# Altium schematic sheet STM32F401R.SchDoc
size A4
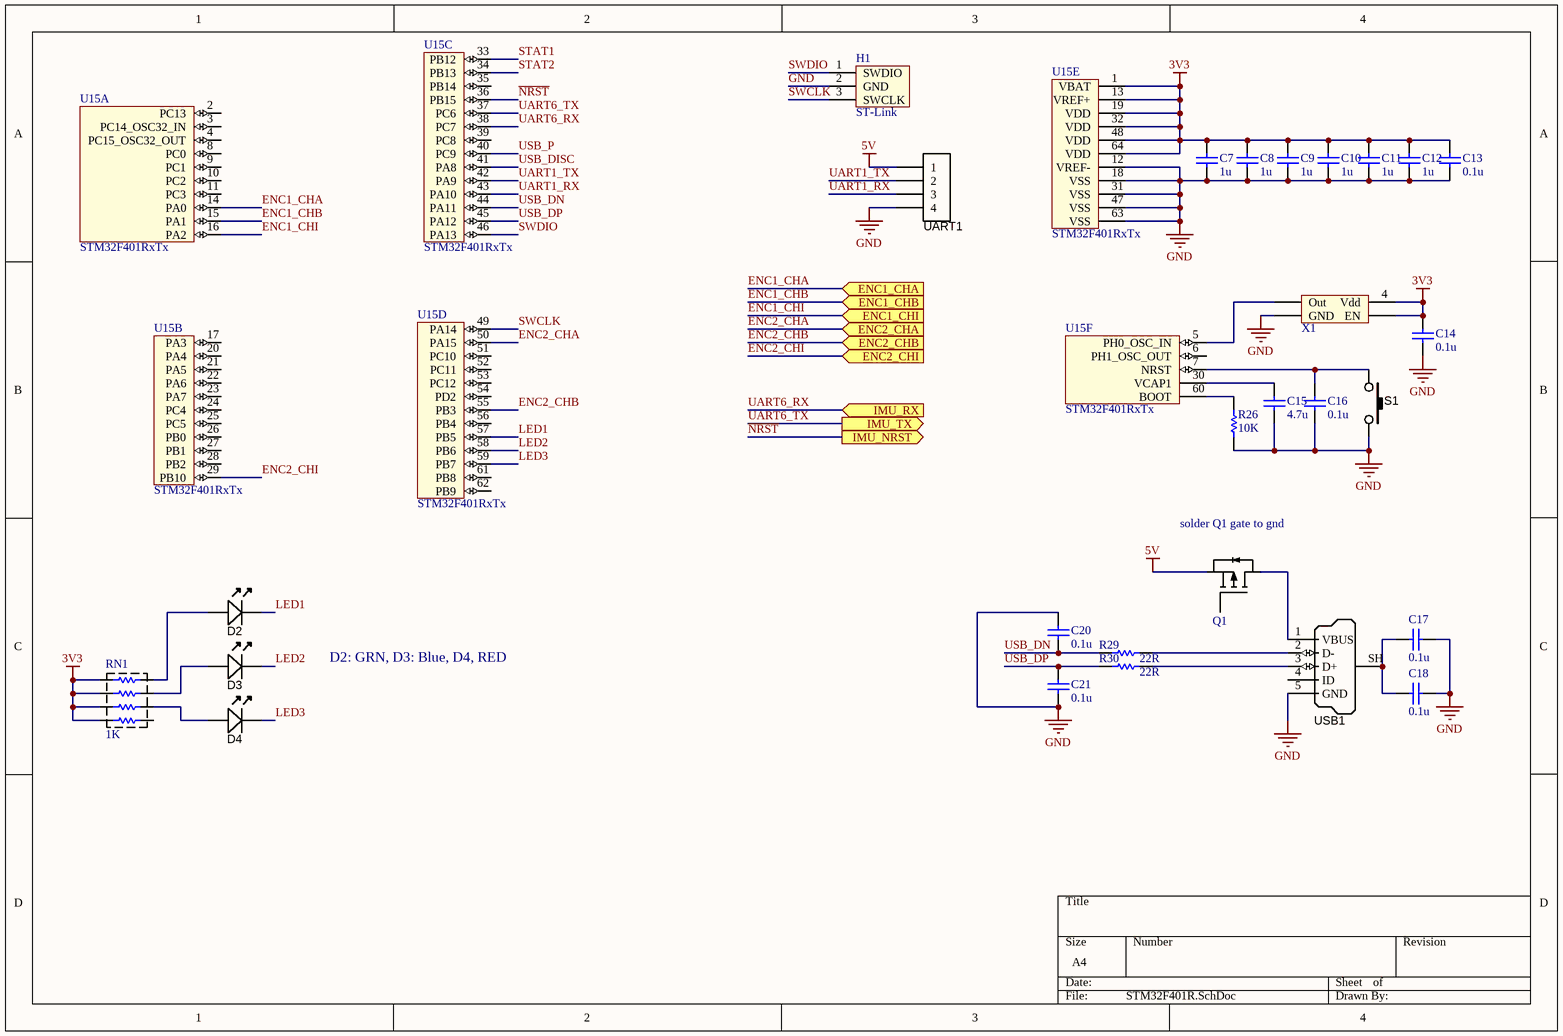
[diagram p0: STM32F401R.SchDoc]

## Parts
C7  value 1u  [CAPC1608X90N]  (hidden comment: Cap)
C8  value 1u  [CAPC1608X90N]  (hidden comment: Cap)
C9  value 1u  [CAPC1608X90N]  (hidden comment: Cap)
C10  value 1u  [CAPC1608X90N]  (hidden comment: Cap)
C11  value 1u  [CAPC1608X90N]  (hidden comment: Cap)
C12  value 1u  [CAPC1608X90N]  (hidden comment: Cap)
C13  value 0.1u  [CAPC1608X90N]  (hidden comment: Cap)
C14  value 0.1u  [CAPC1608X90N]  (hidden comment: Cap)
C15  value 4.7u  [CAPC1608X90N]  (hidden comment: Cap)
C16  value 0.1u  [CAPC1608X90N]  (hidden comment: Cap)
C17  value 0.1u  [CAPC1608X90N]  (hidden comment: Cap)
C18  value 0.1u  [CAPC1608X90N]  (hidden comment: Cap)
C20  value 0.1u  [CAPC1608X90N]  (hidden comment: Cap)
C21  value 0.1u  [CAPC1608X90N]  (hidden comment: Cap)
D2  LED_Green_GullWing  [LED-0805-A]  (value not drawn)
D3  LED_Green_GullWing  [LED-0805-A]  (value not drawn)
D4  LED_Green_GullWing  [LED-0805-A]  (value not drawn)
H1  ST-Link  [ST-Link]
Q1  DMP4010SK3Q  [TO-252]  (value not drawn)
R26  value 10K  [RESC1608X55N]  (hidden comment: Res1)
R29  value 22R  [RESC1608X55N]  (hidden comment: Res1)
R30  value 22R  [RESC1608X55N]  (hidden comment: Res1)
RN1  value 1K  [RESCAXS50P160X320X70-8N]  (hidden comment: resistor network)
S1  SW_THT_PB_4.3mm  [TACT_SWT-SMD-4.4]  (value not drawn)
U15  STM32F401RxTx  [LQFP64]  (parts A,B,C,D,E,F of 6)
UART1  Programmer  [HDR1X4_2.54MMP]  (value not drawn)  (no BOM)
USB1  USB Micro Type B  [USB_MICRO-B]  (value not drawn)
X1  ASV-8.000MHZ-EJ-T  [ASV SERIES]  (value not drawn)

## Ports
ENC1_CHA (in), ENC1_CHB (in), ENC1_CHI (in), ENC2_CHA (in), ENC2_CHB (in), ENC2_CHI (in), IMU_NRST (out), IMU_RX (in), IMU_TX (out)

## Nets
3V3: C7.2 C8.2 C9.2 C10.2 C11.2 C12.2 C13.2 C14.2 RN1.1 RN1.2 RN1.3 RN1.4 U15.1(VBAT) U15.13(VREF+) U15.19(VDD) U15.32(VDD) U15.48(VDD) U15.64(VDD) X1.1(EN) X1.4(Vdd)
5V: Q1.3(S) UART1.1
GND: C7.1 C8.1 C9.1 C10.1 C11.1 C12.1 C13.1 C14.1 C15.1 C16.1 C17.2 C18.2 C20.2 C21.1 H1.2(GND) R26.1 S1.2 U15.12(VREF-) U15.18(VSS) U15.31(VSS) U15.47(VSS) U15.63(VSS) UART1.4 USB1.5(GND) X1.2(GND)
ENC1_CHA: U15.14(PA0) ; port ENC1_CHA
ENC1_CHB: U15.15(PA1) ; port ENC1_CHB
ENC1_CHI: U15.16(PA2) ; port ENC1_CHI
ENC2_CHA: U15.50(PA15) ; port ENC2_CHA
ENC2_CHB: U15.55(PB3) ; port ENC2_CHB
ENC2_CHI: U15.29(PB10) ; port ENC2_CHI
LED1: D2.K U15.57(PB5)
LED2: D3.K U15.58(PB6)
LED3: D4.K U15.59(PB7)
~{NRST}: U15.36(PB15) ; port IMU_NRST
STAT1: U15.33(PB12)
STAT2: U15.34(PB13)
SWCLK: H1.3(SWCLK) U15.49(PA14)
SWDIO: H1.1(SWDIO) U15.46(PA13)
UART1_RX: U15.43(PA10) UART1.3
UART1_TX: U15.42(PA9) UART1.2
UART6_RX: U15.38(PC7) ; port IMU_RX
UART6_TX: U15.37(PC6) ; port IMU_TX
USB_DISC: U15.41(PA8)
USB_DN: C20.1 R29.1 U15.44(PA11)
USB_DP: C21.2 R30.1 U15.45(PA12)
USB_P: U15.40(PC9)
NetC15_2: C15.2 U15.30(VCAP1)
NetC16_2: C16.2 S1.1 U15.7(NRST)
NetC17_1: C17.1 C18.1 USB1.SH(Shell)
NetD2_A: D2.A RN1.8
NetD3_A: D3.A RN1.7
NetD4_A: D4.A RN1.6
NetQ1_4: Q1.4(D) USB1.1(VBUS)
NetR26_2: R26.2 U15.60(BOOT)
NetR29_2: R29.2 USB1.2(D-)
NetR30_2: R30.2 USB1.3(D+)
NetU15_5: U15.5(PH0_OSC_IN) X1.3(Out)

Not connected (* = marked no-connect by the designer): Q1 1(G); RN1 5; U15 2(PC13) 3(PC14_OSC32_IN) 4(PC15_OSC32_OUT) 6(PH1_OSC_OUT) 8(PC0) 9(PC1) 10(PC2) 11(PC3) 17(PA3) 20(PA4) 21(PA5) 22(PA6) 23(PA7) 24(PC4) 25(PC5) 26(PB0) 27(PB1) 28(PB2) 35(PB14) 39(PC8) 51(PC10) 52(PC11) 53(PC12) 54(PD2) 56(PB4) 61(PB8) 62(PB9); USB1 4(ID)

## Notes on the sheet
- (near Q1) solder Q1 gate to gnd
- D2: GRN, D3: Blue, D4, RED

## Library data of the parts
C7-C18 C20 C21 = Cap: Capacitor; Published: 8-Jun-2000; LatestRevisionDate: 17-Jul-2002; LatestRevisionNote: Re-released for DXP Platform.; PackageReference: RAD-0.3; Publisher: Altium Limited; PackageDescription: Radial Cap, Thru-Hole; 2 Leads; 0.3 in Pin Spacing
D2-D4 = LED_Green_GullWing: LED Gull-wing SMD High-intensity Green 450mcd 574nm; Manufacturer 1: Ligitek; Manufacturer Part Number 1: L8UG9033/TR1; Ratings: 450 mcd; 574 nm; Material: AlGaInP; SCDType: source; Package / Case: 4.6mm Gull-Wing; Color: Green
H1 = ST-Link: ST-Link header with silkscreen
R26 R29 R30 = Res1: Resistor; Published: 8-Jun-2000; LatestRevisionDate: 17-Jul-2002; LatestRevisionNote: Re-released for DXP Platform.; PackageReference: AXIAL-0.3; Publisher: Altium Limited; PackageDescription: Axial Device, Thru-Hole; 2 Leads; 0.3 in Pin Spacing
RN1 = RES_NET
S1 = SW_THT_PB_4.3mm: Switch, tact, 4.3mm stem; Manufacturer 1: Bond-Tact; Manufacturer Part Number 1: TS-1143-WP-300; SCDType: spec; Function: Speed; Package / Case: 6.5x6.5mm; 4.3mm stem; Material: Brass/Nylon/Ag plating
UART1 = Header4P: Header 4-pin
USB1 = USB_Micro_TypeB: Connector SMD USB Micro Type B middle mount; Manufacturer 1: Molex Inc; Manufacturer Part Number 1: 47491-0001; SCDType: undef; Package / Case: SMD; Supplier 1: Digi-Key; Supplier Part Number 1: WM17142CT-ND
X1 = ASV-8.000MHZ-EJ-T: 3.3Vdc HCMOS SMD Crystal Clock Oscillator; Manufacturer: Abracon; VDD: 3.3V; Frequency: 8.000MHz